# EAGLE design PowerCR2032 (EAGLE 7.4.0)
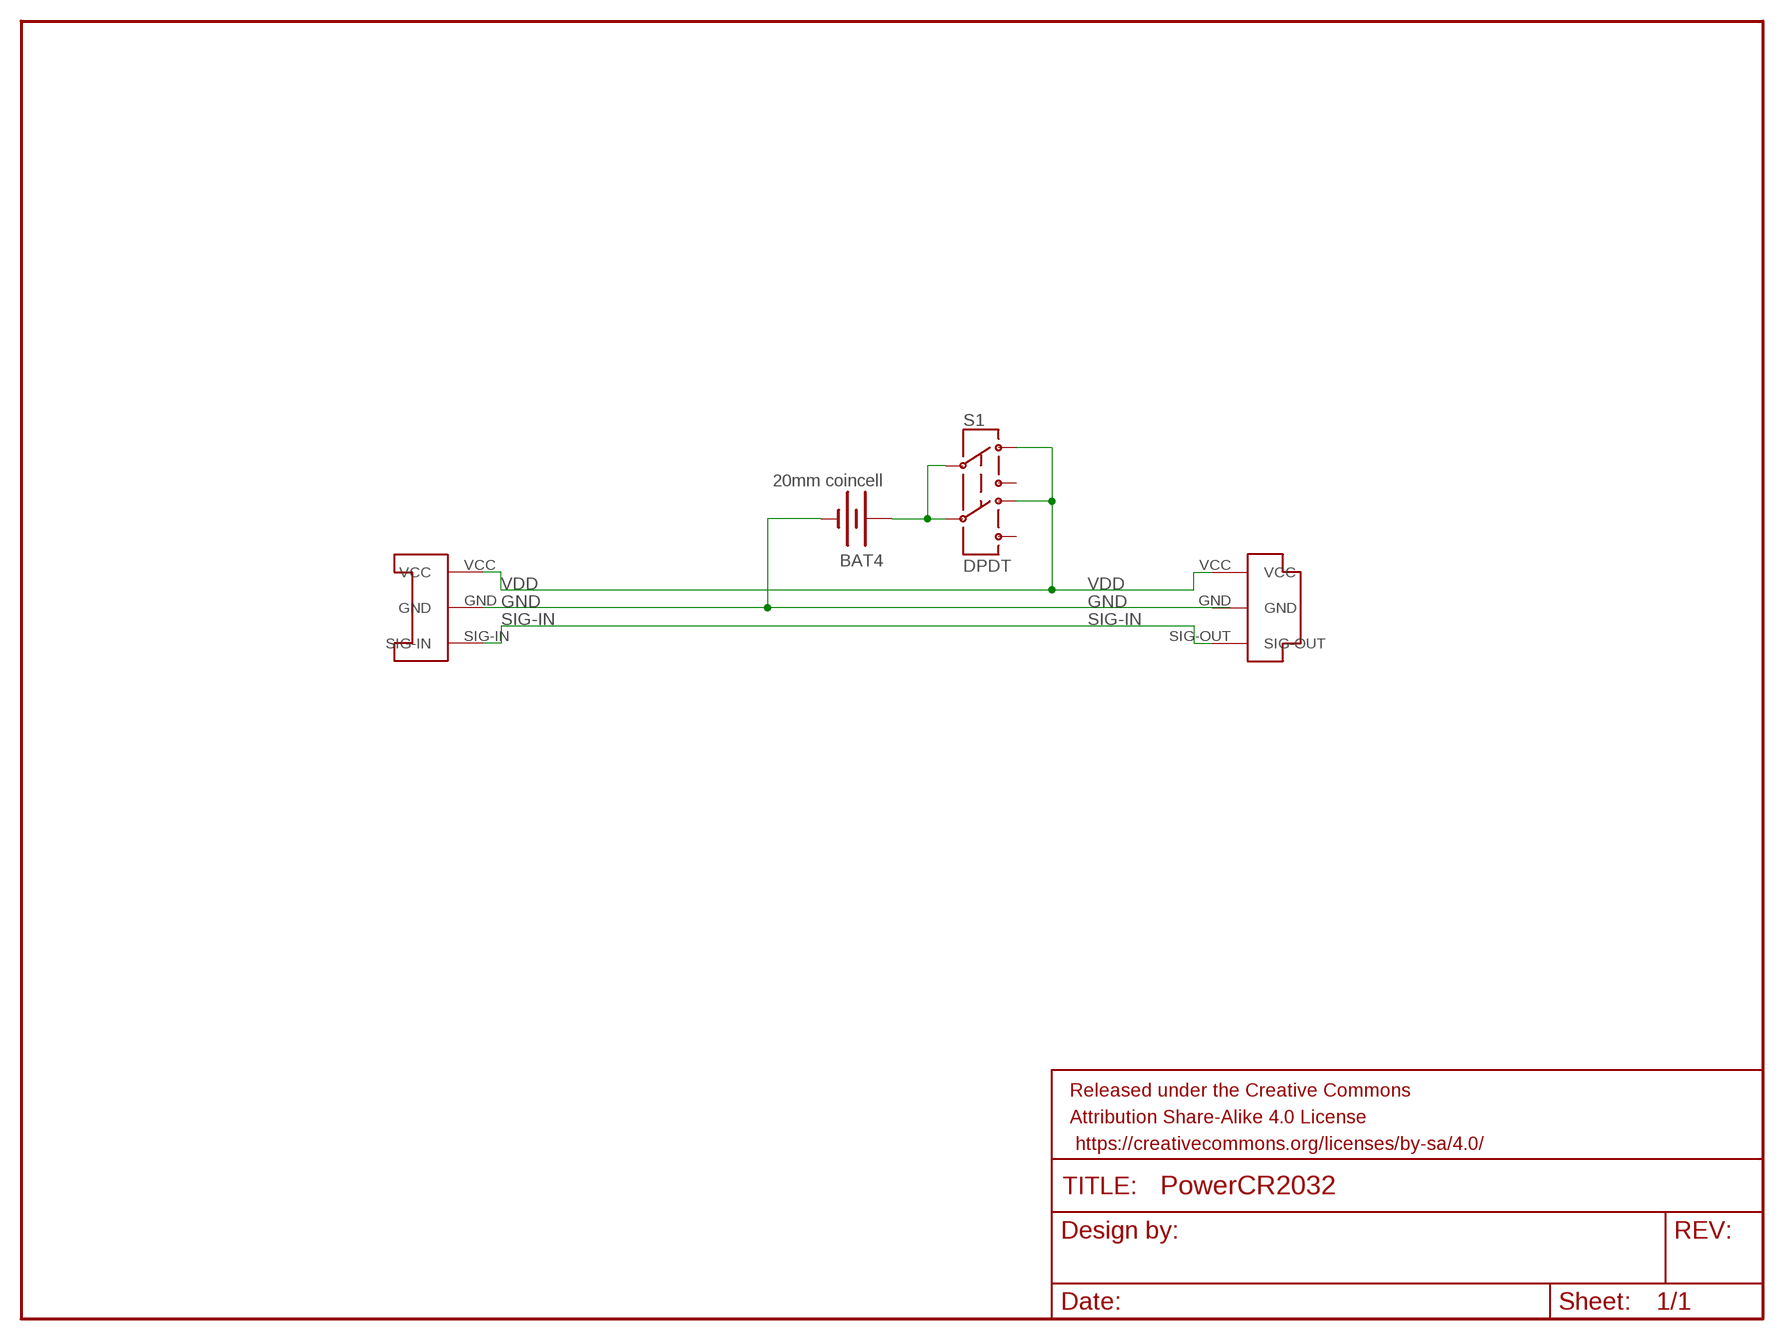
[diagram p0: schematic, sheet 1]

## Parts
BAT4  20mm coincell  BATTERY20MM_4LEGS  [BATTCON_20MM_4LEGS]
FRAME1  FRAME-LETTERNO_PACKAGE  [DUMMY]
S1  DPDT  SWITCH-DPDTAYZ0202  [AYZ0202]
U$1  CONN-SOCKET-3POS-3MM  [SOCKET-3POS-3MM-SMD]
U$2  CONN-PLUG-3POS-3MM  [PLUG-3POS-3MM-SMD]

## Nets
GND: BAT4.2(-) U$1.GND
SIG-IN: U$1.SIG-IN U$2.SIG-OUT
VBAT: BAT4.1(+) S1.2 S1.5
VDD: S1.1 S1.4 U$1.VCC U$2.VCC
Unconnected: S1.3 S1.6

## Power pins joined to a net without a drawn wire
GND: U$2.GND

## Library data of the parts
BAT4 = SparkFun-Electromechanical:BATTERY: Battery Holders Various common sizes : AA, AAA, 18650 (PRT-12895), 20mm coin cell and 12mm coin cell. 20MM_4LEGS, BATT-10373; PROD_ID: BATT-10373
FRAME1 = SparkFun-Aesthetics:FRAME-LETTER: Schematic Frame Standard 8.5x11 US Letter frame; DESIGNER: Nobody; VERSION: v01
S1 = SparkFun-Electromechanical:SWITCH-DPDT: DPDT Version of the COM-00597; PROD_ID: SWCH-08179
U$1 = EmbeddedPlayground:CONN-SOCKET-3POS-3MM: Surface mount board to board connector. Female socket, 3 position.
U$2 = EmbeddedPlayground:CONN-PLUG-3POS-3MM: Surface mount board to board connector. Female socket, 3 position.

## Board
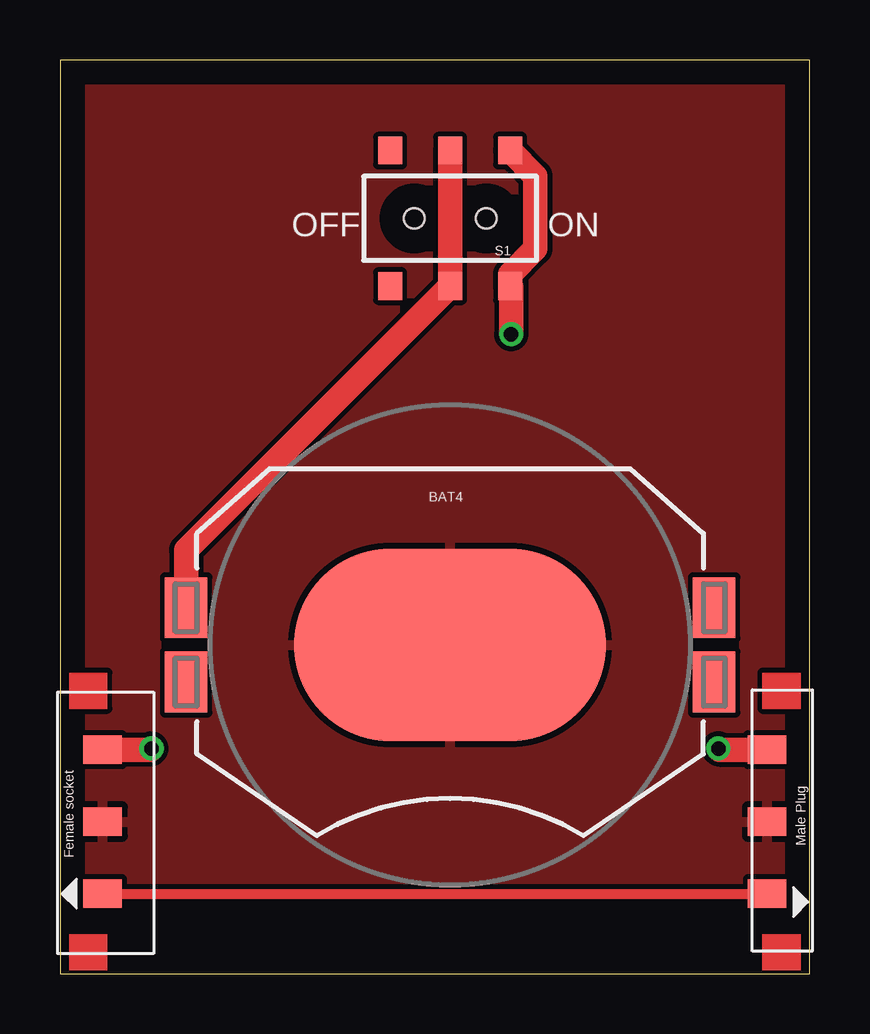
[diagram p1: board, top side]
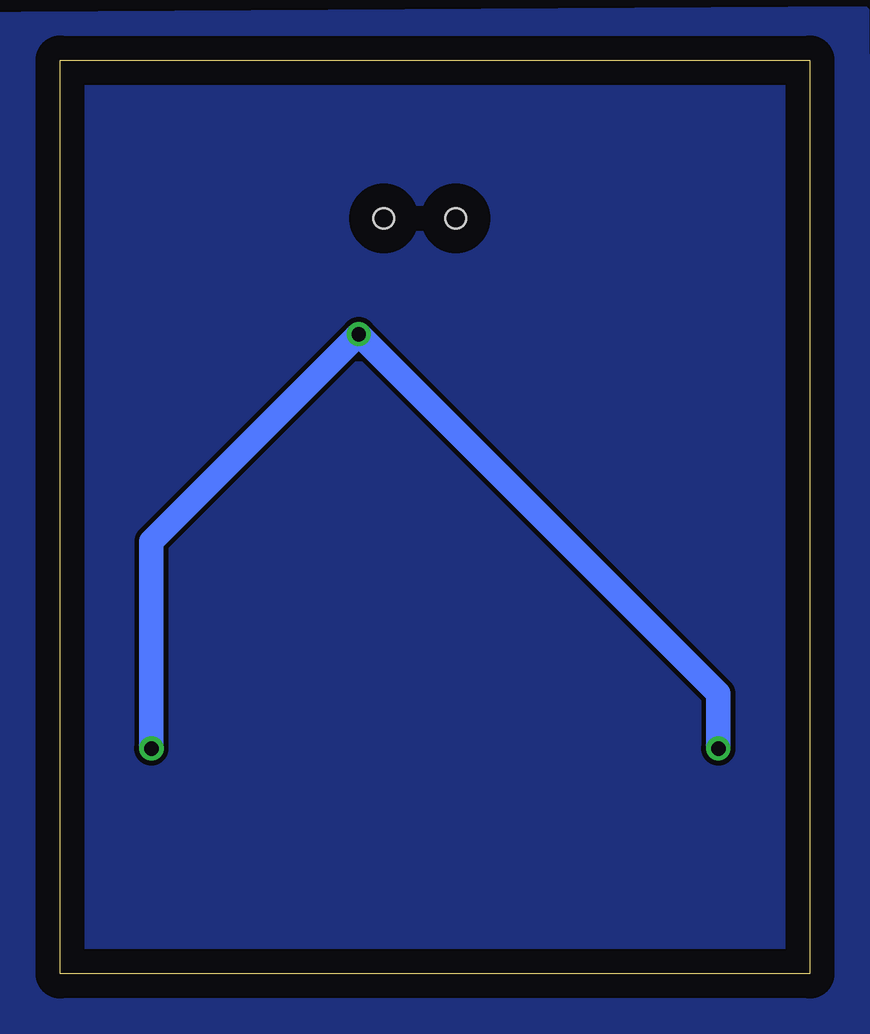
[diagram p2: board, bottom side, seen from below]

Size 31.24 x 38.1 mm. Coordinates in mm from the lower left corner, seen from the top.
Outline: 0,0 31.24,0 31.24,38.1 0,38.1 0,0
Copper layers (1*16): Top 0.035mm / dielectric 1.5mm / Bottom 0.035mm
Design rules "default": minimum track width 10mil, minimum drill 24mil, track to track 8mil, track to pad 8mil, pad to pad 8mil, via to via 8mil, smd to smd 8mil, copper to edge 40mil, drill to drill 8mil, minimum pad ring 10mil, minimum via ring 8mil, stop-mask expansion 4mil, vias tented up to drill 0mil, thermal gap 10mil

### Footprints (pad centres in the part's own frame; a part is rotated, then mirrored left to right if it is on the bottom)
BATTCON_20MM_4LEGS = smd 1.778 x 2.54: 1 -11,1.55; 3 11,1.55; P$1 -11,-1.55; P$2 11,-1.55 | smd 13 x 8: 2 0,0
AYZ0202 = smd 1 x 1.15: 1 -2.5,2.825; 2 0,2.825; 3 2.5,2.825; 4 -2.5,-2.825; 5 0,-2.825; 6 2.5,-2.825 | hole 0.85: 1.5,0; -1.5,0
SOCKET-3POS-3MM-SMD = smd 1.2 x 1.6: GND 0,0; SIG-IN -3,0; VCC 3,0
PLUG-3POS-3MM-SMD = smd 1.2 x 1.6: GND 0,0; SIG-OUT 3,0; VCC -3,0

### Placement (x,y rotation side)
BAT4  16.26,13.72 0 top
FRAME1  0,0 0 top
S1  16.26,31.5 180 top
U$1  1.78,6.35 90 top
U$2  29.46,6.35 270 top

### Tracks (layer width: path | path; a pad name or v marks a point on that pad's centre or on a via)
GND
  pour Top: -2.54,39.62 -2.54,-2.54 34.8,-2.54 34.8,39.62
  pour Bottom: -2.29,40.13 36.07,39.88 35.81,-2.79 -2.54,-2.54
N$5  (via drill 0.6)
  other vias: 3.81,9.4
N$6  (via drill 0.6)
  other vias: 27.43,9.4
N$7  (via drill 0.6)
  other vias: 18.8,26.67
SIG-IN
  Top 0.406: U$1.SIG-IN U$2.SIG-OUT
VBAT
  Top 1.016: S1.5 S1.2 5.26,17.67 BAT4.1
VDD  (via drill 0.6)
  Top 1.016: S1.4 19.81,33.27 19.81,30.23 18.76,29.17 S1.1 18.8,28.63 v18.8,26.67 | v27.43,9.4 27.48,9.35 U$2.VCC | v3.81,9.4 3.76,9.35 U$1.VCC
  Bottom 1.016: v27.43,9.4 27.43,18.03 v18.8,26.67 3.81,11.68 v3.81,9.4

### Text on the board
tPlace: OFF | ON